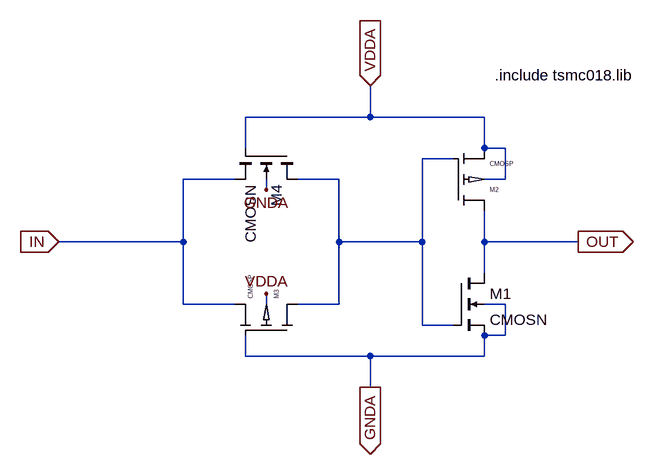
[diagram p0: schematic Matched_Inverter.asc]
Matched_Inverter.asc, the LTspice schematic file:
Version 4
SHEET 1 880 680
WIRE 240 16 240 -32
WIRE 240 16 48 16
WIRE 416 16 240 16
WIRE 48 64 48 16
WIRE 416 64 416 16
WIRE 448 64 416 64
WIRE 368 80 320 80
WIRE 32 112 -48 112
WIRE 192 112 128 112
WIRE 448 112 448 64
WIRE 448 112 416 112
WIRE 80 128 80 112
WIRE -48 208 -48 112
WIRE -48 208 -240 208
WIRE 192 208 192 112
WIRE 320 208 320 80
WIRE 320 208 192 208
WIRE 416 208 416 160
WIRE 560 208 416 208
WIRE 416 256 416 208
WIRE -48 304 -48 208
WIRE 32 304 -48 304
WIRE 80 304 80 288
WIRE 192 304 192 208
WIRE 192 304 128 304
WIRE 448 304 416 304
WIRE 320 336 320 208
WIRE 368 336 320 336
WIRE 448 352 448 304
WIRE 448 352 416 352
WIRE 48 384 48 352
WIRE 240 384 48 384
WIRE 416 384 416 352
WIRE 416 384 240 384
WIRE 240 432 240 384
FLAG 80 288 VDDA
FLAG 80 128 GNDA
FLAG 240 -32 VDDA
IOPIN 240 -32 In
FLAG 240 432 GNDA
IOPIN 240 432 Out
FLAG -240 208 IN
IOPIN -240 208 In
FLAG 560 208 OUT
IOPIN 560 208 Out
SYMBOL cmosn 368 256 R0
SYMATTR InstName M1
SYMATTR Value2 l=180n w=4u
SYMBOL cmosp 368 160 M180
SYMATTR InstName M2
SYMATTR Value2 l=180n w=20u
SYMBOL cmosp 128 352 M270
SYMATTR InstName M3
SYMATTR Value2 l=180n w=1u
SYMBOL cmosn 128 64 R90
SYMATTR InstName M4
SYMATTR Value2 l=180n w=270n
TEXT 432 -48 Left 2 !.include tsmc018.lib

The netlist it stands for:
* Matched_Inverter.asc
M1 OUT N001 GNDA GNDA CMOSN l=180n w=4u
M2 OUT N001 VDDA VDDA CMOSP l=180n w=20u
M3 N001 GNDA IN VDDA CMOSP l=180n w=1u
M4 N001 VDDA IN GNDA CMOSN l=180n w=270n
.model NMOS NMOS
.model PMOS PMOS
.lib standard.mos
.include tsmc018.lib
.lib tsmc018.lib
.backanno
.end